# EAGLE design Bus IO Device Simulator (EAGLE 6.6.0)
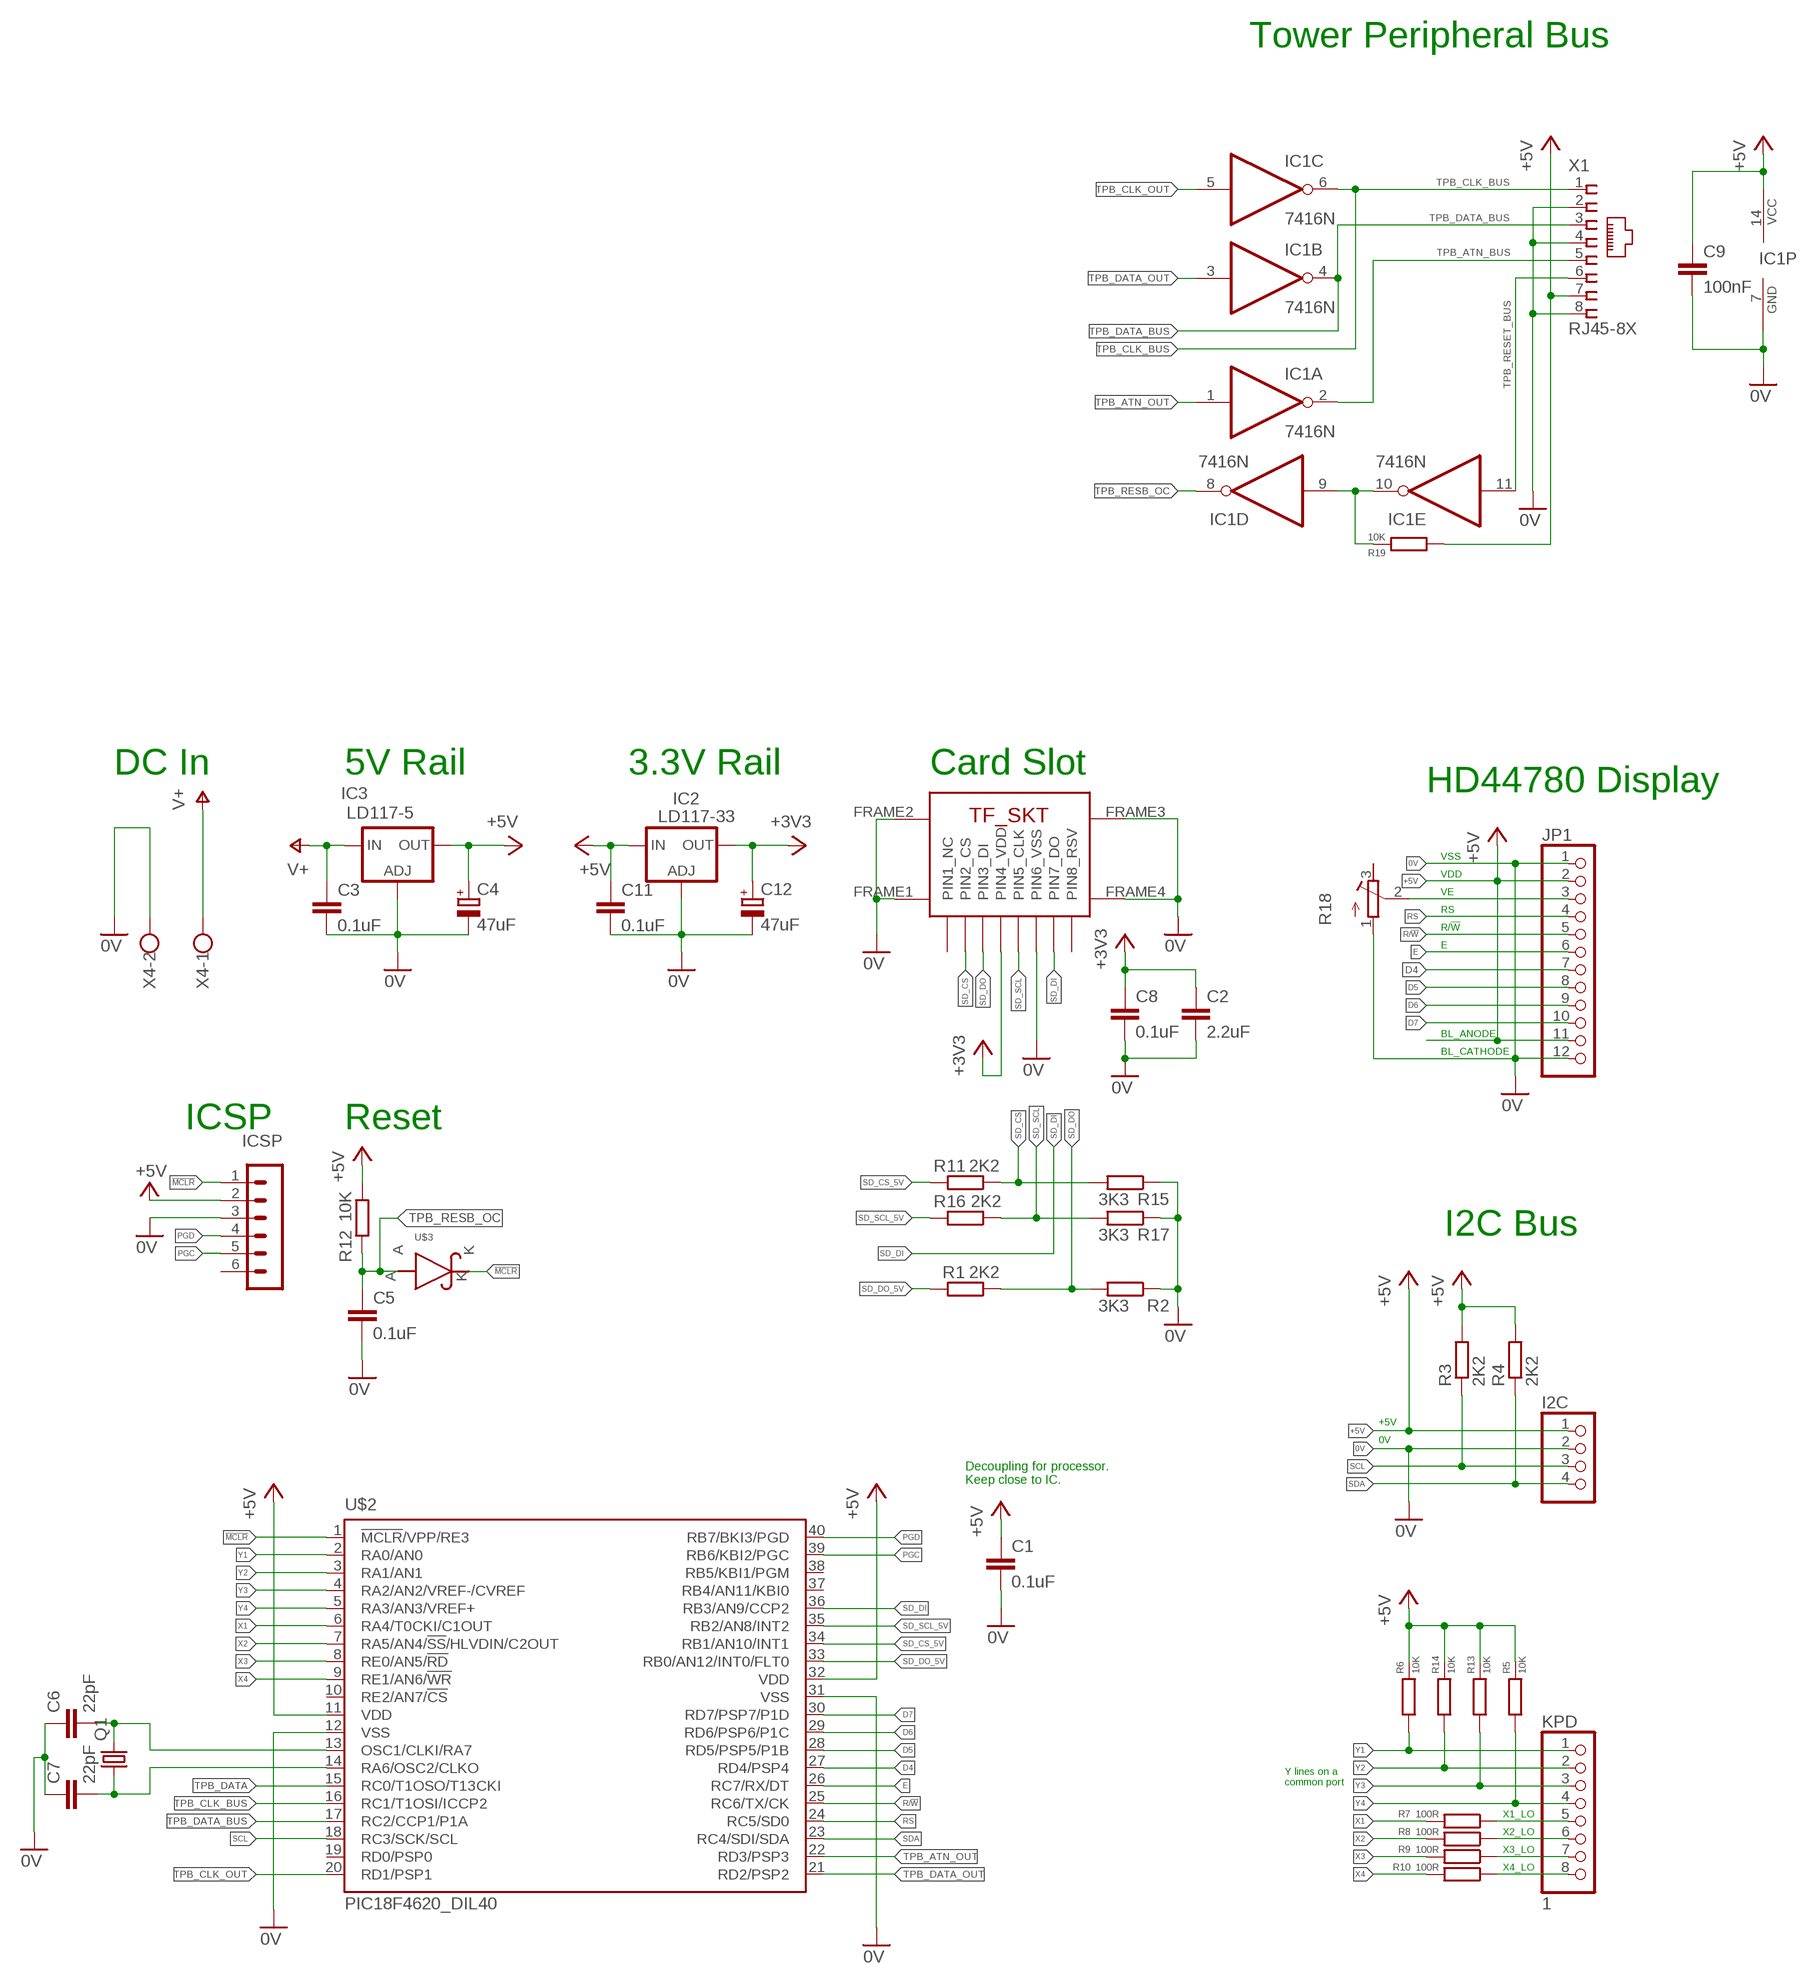
[diagram p0: schematic, sheet 1]

## Parts
C1  0.1uF  C-EUC0603  [C0603]
C2  2.2uF  C-EUC1206  [C1206]
C3  0.1uF  C-EUC0603  [C0603]
C4  47uF  CPOL-EUSMCD  [SMC_D]
C5  0.1uF  C-EUC0603  [C0603]
C6  22pF  C-EUC0603  [C0603]
C7  22pF  C-EUC0603  [C0603]
C8  0.1uF  C-EUC0603  [C0603]
C9  100nF  C-EU050-025X075  [C050-025X075]
C11  0.1uF  C-EUC0603  [C0603]
C12  47uF  CPOL-EUSMCD  [SMC_D]
I2C  PINHD-1X4  [1X04]
IC1  7416N  [DIL14]
IC2  LD117-33  LD117AS50TR  [SOT223]
IC3  LD117-5  LD117AS50TR  [SOT223]
ICSP  MA06-1  [MA06-1]
JP1  PINHD-1X12  [1X12]
KPD  1  PINHD-1X8  [1X08]
Q1  CRYSTALHC49U-V  [HC49U-V]
R1  2K2  R-EU_R0603  [R0603]
R2  3K3  R-EU_R0603  [R0603]
R3  2K2  R-EU_R0603  [R0603]
R4  2K2  R-EU_R0603  [R0603]
R5  10K  R-EU_R0603  [R0603]
R6  10K  R-EU_R0603  [R0603]
R7  100R  R-EU_R0603  [R0603]
R8  100R  R-EU_R0603  [R0603]
R9  100R  R-EU_R0603  [R0603]
R10  100R  R-EU_R0603  [R0603]
R11  2K2  R-EU_R0603  [R0603]
R12  10K  R-EU_R0603  [R0603]
R13  10K  R-EU_R0603  [R0603]
R14  10K  R-EU_R0603  [R0603]
R15  3K3  R-EU_R0603  [R0603]
R16  2K2  R-EU_R0603  [R0603]
R17  3K3  R-EU_R0603  [R0603]
R18  R-TRIMM64W  [RTRIM64W]
R19  10K  R-EU_R0603  [R0603]
U$1  TF_SKT  [CLIP_DOWN]
U$2  PIC18F4620_DIL40  [DIL40]
U$3  ZHCS750  [SOT23]
X1  RJ45-8X  [RJ45-NO-SHIELD]
X4  W237-102  [W237-102]

## Nets
0V: C1.2 C2.2 C3.2 C4.- C5.2 C6.1 C7.1 C8.2 C9.2 C11.2 C12.- I2C.2 IC1.7(P:GND) IC2.1(ADJ) IC3.1(ADJ) ICSP.3 JP1.1 JP1.12 R2.1 R15.1 R17.1 R18.1(E) U$1.FRAME1 U$1.FRAME2 U$1.FRAME3 U$1.FRAME4 U$1.PIN6_VSS U$2.12(VSS) U$2.31(VSS) X1.2 X1.4 X1.8 X4.2
!MCLR: ICSP.1 U$2.1(!MCLR!/VPP/RE3) U$3.K
+3V3: C2.1 C8.1 C12.+ IC2.4(OUT) U$1.PIN4_VDD
+5V: C1.1 C4.+ C9.1 C11.1 I2C.1 IC1.14(P:VCC) IC2.3(IN) IC3.4(OUT) ICSP.2 JP1.2 JP1.11 R3.2 R4.2 R5.2 R6.2 R12.2 R13.2 R14.2 R19.1 U$2.11(VDD) U$2.32(VDD) X1.7
D4: JP1.7 U$2.27(RD4/PSP4)
D5: JP1.8 U$2.28(RD5/PSP5/P1B)
D6: JP1.9 U$2.29(RD6/PSP6/P1C)
D7: JP1.10 U$2.30(RD7/PSP7/P1D)
E: JP1.6 U$2.26(RC7/RX/DT)
N$1: C6.2 Q1.2 U$2.13(OSC1/CLKI/RA7)
N$2: C7.2 Q1.1 U$2.14(RA6/OSC2/CLKO)
N$3: JP1.3 R18.2(S)
N$4: IC1.9(D:I) IC1.10(E:O) R19.2
PGC: ICSP.5 U$2.39(RB6/KBI2/PGC)
PGD: ICSP.4 U$2.40(RB7/BKI3/PGD)
R/!W: JP1.5 U$2.25(RC6/TX/CK)
RS: JP1.4 U$2.24(RC5/SD0)
SCL: I2C.3 R3.1 U$2.18(RC3/SCK/SCL)
SD_CS: R11.1 R15.2 U$1.PIN2_CS
SD_CS_5V: R11.2 U$2.34(RB1/AN10/INT1)
SD_DI: U$1.PIN7_DO U$2.36(RB3/AN9/CCP2)
SD_DO: R1.1 R2.2 U$1.PIN3_DI
SD_DO_5V: R1.2 U$2.33(RB0/AN12/INT0/FLT0)
SD_SCL: R16.1 R17.2 U$1.PIN5_CLK
SD_SCL_5V: R16.2 U$2.35(RB2/AN8/INT2)
SDA: I2C.4 R4.1 U$2.23(RC4/SDI/SDA)
TPB_ATN_BUS: IC1.2(A:O) X1.5
TPB_ATN_OUT: IC1.1(A:I) U$2.22(RD3/PSP3)
TPB_CLK_BUS: IC1.6(C:O) U$2.16(RC1/T1OSI/ICCP2) X1.1
TPB_CLK_OUT: IC1.5(C:I) U$2.20(RD1/PSP1)
TPB_DATA: U$2.15(RC0/T1OSO/T13CKI)
TPB_DATA_BUS: IC1.4(B:O) U$2.17(RC2/CCP1/P1A) X1.3
TPB_DATA_OUT: IC1.3(B:I) U$2.21(RD2/PSP2)
TPB_RESB_OC: C5.1 IC1.8(D:O) R12.1 U$3.A
TPB_RESET_BUS: IC1.11(E:I) X1.6
V+: C3.1 IC3.3(IN) X4.1
X1: R7.2 U$2.6(RA4/T0CKI/C1OUT)
X1_LO: KPD.5 R7.1
X2: R8.2 U$2.7(RA5/AN4/!SS!/HLVDIN/C2OUT)
X2_LO: KPD.6 R8.1
X3: R9.2 U$2.8(RE0/AN5/!RD)
X3_LO: KPD.7 R9.1
X4: R10.2 U$2.9(RE1/AN6/!WR)
X4_LO: KPD.8 R10.1
Y1: KPD.1 R6.1 U$2.2(RA0/AN0)
Y2: KPD.2 R14.1 U$2.3(RA1/AN1)
Y3: KPD.3 R13.1 U$2.4(RA2/AN2/VREF-/CVREF)
Y4: KPD.4 R5.1 U$2.5(RA3/AN3/VREF+)
Unconnected: IC1.12(F:O) IC1.13(F:I) ICSP.6 R18.3(A) U$1.PIN1(PIN1_NC) U$1.PIN8_RSV U$2.10(RE2/AN7/!CS) U$2.19(RD0/PSP0) U$2.37(RB4/AN11/KBI0) U$2.38(RB5/KBI1/PGM)

## Notes on the sheet
- Tower Peripheral Bus
- DC In | 5V Rail | 3.3V Rail | Card Slot
- HD44780 Display
- VSS
- VDD
- VE
- RS
- R/!W
- E
- BL_ANODE
- BL_CATHODE
- ICSP | Reset
- I2C Bus
- +5V
- 0V
- Decoupling for processor.
  Keep close to IC.
- Y lines on a
  common port
- X1_LO
- X2_LO
- X3_LO
- X4_LO

## Library data of the parts
C1-C3 C5-C9 C11 = rcl:C-EU: CAPACITOR, European symbol
C4 C12 = rcl:CPOL-EU: POLARIZED CAPACITOR, European symbol
I2C = pinhead:PINHD-1X4: PIN HEADER
IC1 = 74xx-us:74*16: Hex INVERTER, open collector, high-voltage
IC2 IC3 = v-reg:LD117A?*: Low drop fixed and adjustable positive voltage regulators 1 A Source: http://www.st.com/stonline/products/literature/ds/7194/ld1117axx.pdf
ICSP = con-lstb:MA06-1: PIN HEADER; OC_FARNELL: unknown; OC_NEWARK: unknown
JP1 = pinhead:PINHD-1X12: PIN HEADER
KPD = pinhead:PINHD-1X8: PIN HEADER
Q1 = crystal:CRYSTAL: CRYSTAL; OC_FARNELL: 1666969; OC_NEWARK: unknown
R1-R17 R19 = rcl:R-EU_: RESISTOR, European symbol
R18 = rcl:R-TRIMM: Trimm resistor
U$1 = Duncs Special Conn:TF_SKT: Clipdown Transflash Socket. Footprint for el-cheapo sockets bought from eBay. Delete when exhausted.
U$2 = microchip-pic-extras:PIC18F4620_DIL40: DIL40 Version of the PIC18F4620. 60mil spacing between rows and 10mil between pins on a row. Please note this has not been tested yet
U$3 = Duncs Diodes:ZHCS750: ZHCS750 750mA Schottky signal diode in a SOT-23 package. See datasheet for further information.
X1 = con-tycoelectronics:RJ45: CORCOM Modular RJ Jacks No Shield Source: www.tycoelectronics.com .. ENG_DS_1654001_1099_RJ_L_0507.pdf; MPN: RJ45-8X; OC_FARNELL: unknown; OC_NEWARK: 16R6101
X4 = con-wago-500:W237-102: WAGO SCREW CLAMP; MPN: 237-102; OC_FARNELL: unknown; OC_NEWARK: 70K9898

## Net classes
0 low voltage: width 0.305 mm, clearance 0.203 mm
1 power traces: width 1.016 mm, clearance 0.254 mm

## Board
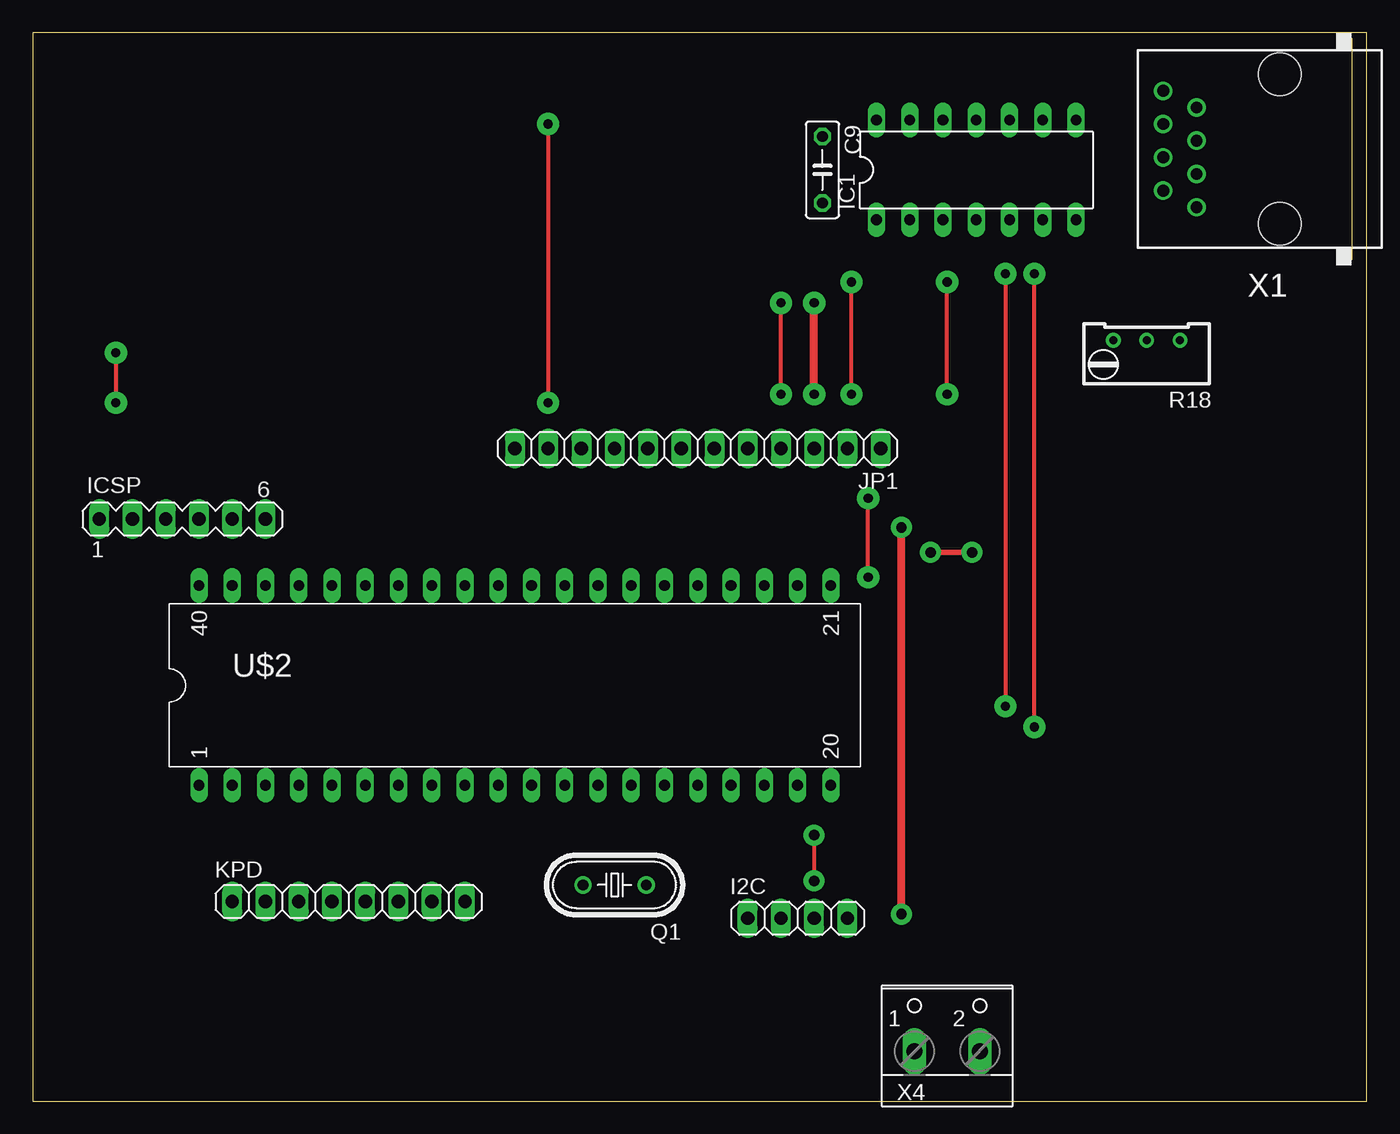
[diagram p1: board, top side]
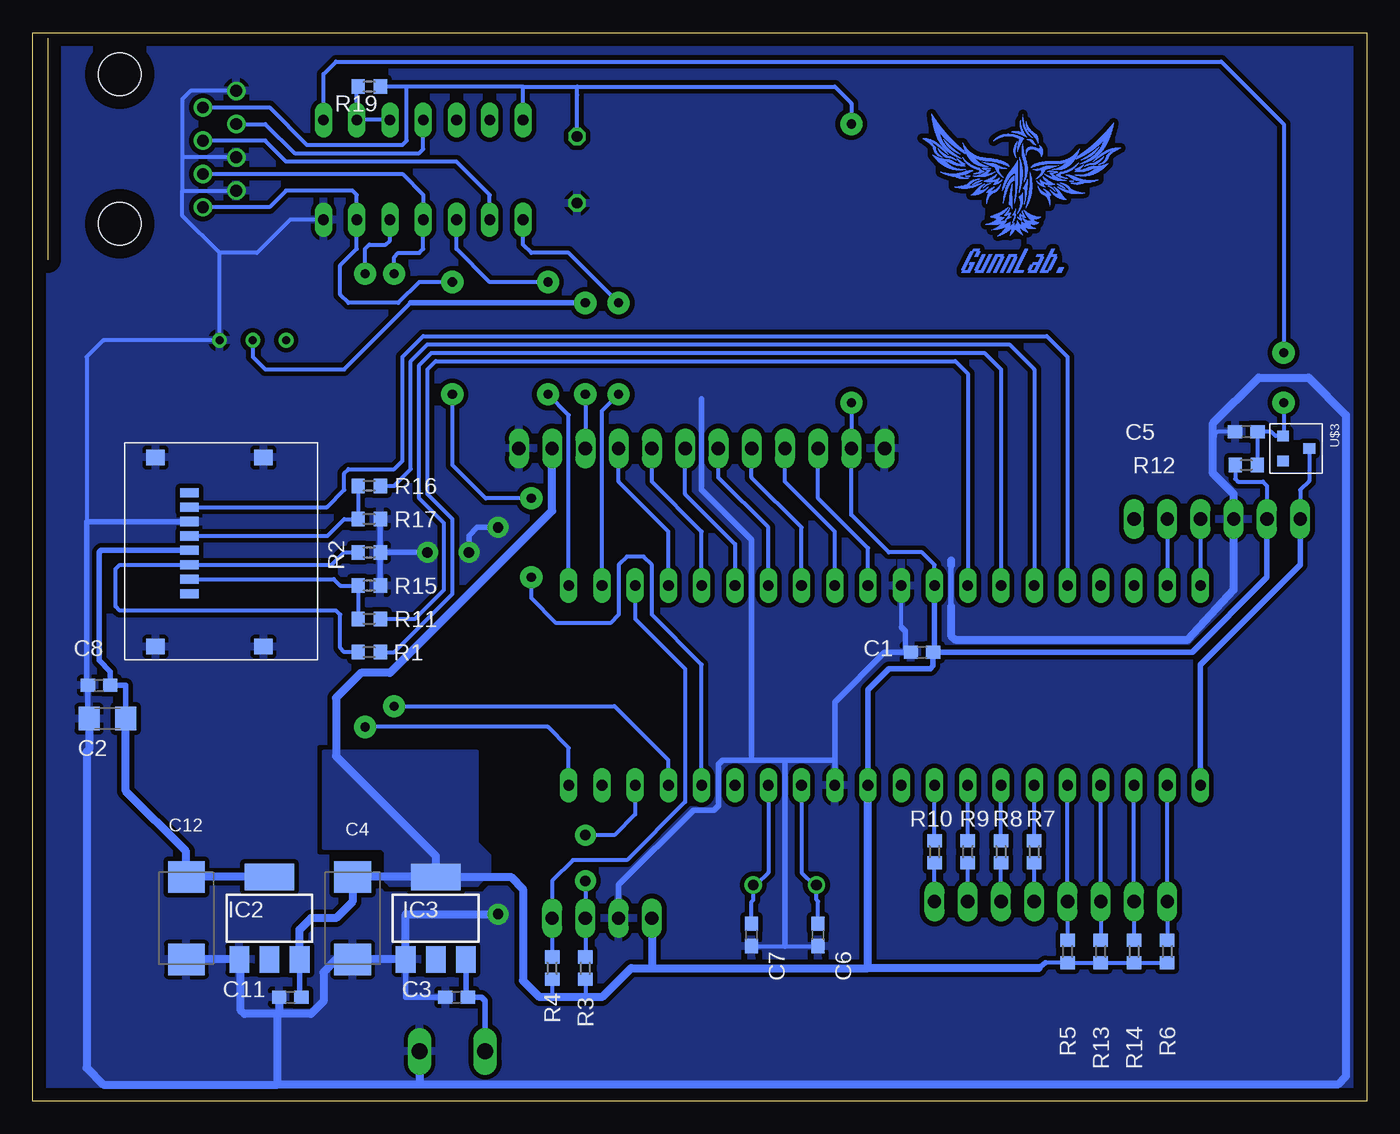
[diagram p2: board, bottom side, seen from below]

Size 101.91 x 81.59 mm. Coordinates in mm from the lower left corner, seen from the top.
Outline: 0,0 101.91,0 101.91,81.59 0,81.59 0,0
Copper layers (1*16): Top 0.035mm / dielectric 1.5mm / Bottom 0.035mm
Design rules "default *": minimum track width 10mil, minimum drill 24mil, track to track 8mil, track to pad 8mil, pad to pad 8mil, via to via 8mil, smd to smd 8mil, copper to edge 40mil, drill to drill 8mil, minimum pad ring 10mil, minimum via ring 8mil, stop-mask expansion 4mil, vias tented up to drill 0mil, thermal gap 12mil

### Footprints (pad centres in the part's own frame; a part is rotated, then mirrored left to right if it is on the bottom)
C0603 = smd 1.1 x 1: 1 -0.85,0; 2 0.85,0
C1206 = smd 1.6 x 1.8: 1 -1.4,0; 2 1.4,0
SMC_D = smd 2.4 x 2.8: + -3.15,0; - 3.15,0
C050-025X075 = drill 0.813 octagon: 1 -2.54,0; 2 2.54,0
1X04 = drill 1.016 long: 1 -3.81,0; 2 -1.27,0; 3 1.27,0; 4 3.81,0
DIL14 = drill 0.813 long: 1 -7.62,-3.81; 2 -5.08,-3.81; 3 -2.54,-3.81; 4 0,-3.81; 5 2.54,-3.81; 6 5.08,-3.81; 7 7.62,-3.81; 8 7.62,3.81; 9 5.08,3.81; 10 2.54,3.81; 11 0,3.81; 12 -2.54,3.81; 13 -5.08,3.81; 14 -7.62,3.81
SOT223 = smd 1.5 x 2: 1 -2.3,-3.15; 2 0,-3.15; 3 2.3,-3.15 | smd 3.8 x 2: 4 0,3.15
MA06-1 = drill 1.016 long: 1 -6.35,0; 2 -3.81,0; 3 -1.27,0; 4 1.27,0; 5 3.81,0; 6 6.35,0
1X12 = drill 1.016 long: 1 -13.97,0; 2 -11.43,0; 3 -8.89,0; 4 -6.35,0; 5 -3.81,0; 6 -1.27,0; 7 1.27,0; 8 3.81,0; 9 6.35,0; 10 8.89,0; 11 11.43,0; 12 13.97,0
1X08 = drill 1.016 long: 1 -8.89,0; 2 -6.35,0; 3 -3.81,0; 4 -1.27,0; 5 1.27,0; 6 3.81,0; 7 6.35,0; 8 8.89,0
HC49U-V = drill 0.813: 1 -2.413,0; 2 2.413,0
R0603 = smd 1 x 1.1: 1 -0.85,0; 2 0.85,0
RTRIM64W = drill 0.61: 1 1.27,-2.54; 2 1.27,0; 3 1.27,2.54
CLIP_DOWN = smd 1.2 x 1.4: FRAME1 -7.2,4.9; FRAME2 7.25,4.9; FRAME3 -7.2,-3.35; FRAME4 7.25,-3.35 | smd 0.7 x 1.4: PIN1 -3.15,2.3; PIN2_CS -2.05,2.3; PIN3_DI -0.95,2.3; PIN4_VDD 0.15,2.3; PIN5_CLK 1.25,2.3; PIN6_VSS 2.35,2.3; PIN7_DO 3.45,2.3; PIN8_RSV 4.55,2.3
DIL40 = drill 0.813 long: 1 -24.13,-7.62; 2 -21.59,-7.62; 3 -19.05,-7.62; 4 -16.51,-7.62; 5 -13.97,-7.62; 6 -11.43,-7.62; 7 -8.89,-7.62; 8 -6.35,-7.62; 9 -3.81,-7.62; 10 -1.27,-7.62; 11 1.27,-7.62; 12 3.81,-7.62; 13 6.35,-7.62; 14 8.89,-7.62; 15 11.43,-7.62; 16 13.97,-7.62; 17 16.51,-7.62; 18 19.05,-7.62; 19 21.59,-7.62; 20 24.13,-7.62; 21 24.13,7.62; 22 21.59,7.62; 23 19.05,7.62; 24 16.51,7.62; 25 13.97,7.62; 26 11.43,7.62; 27 8.89,7.62; 28 6.35,7.62; 29 3.81,7.62; 30 1.27,7.62; 31 -1.27,7.62; 32 -3.81,7.62; 33 -6.35,7.62; 34 -8.89,7.62; 35 -11.43,7.62; 36 -13.97,7.62; 37 -16.51,7.62; 38 -19.05,7.62; 39 -21.59,7.62; 40 -24.13,7.62
SOT23 = smd 0.8 x 0.9: A -0.95,-1; K 0,1; NC 0.95,-1
RJ45-NO-SHIELD = drill 0.9 pad 1.4: 1 -4.445,6.35; 2 -3.175,8.89; 3 -1.905,6.35; 4 -0.635,8.89; 5 0.635,6.35; 6 1.905,8.89; 7 3.175,6.35; 8 4.445,8.89 | hole 3.251: -5.715,0; 5.715,0
W237-102 = drill 1.194 long: 1 -2.5,-1.27; 2 2.5,-1.27

### Placement (x,y rotation side)
C1  33.97,34.29 180 bottom
C2  96.2,29.21 180 bottom
C3  69.53,7.94 180 bottom
C4  77.47,13.97 270 bottom
C5  9.21,51.12 180 bottom
C6  41.91,12.7 90 bottom
C7  46.99,12.7 90 bottom
C8  96.84,31.75 180 bottom
C9  60.33,71.12 270 top
C11  82.23,7.94 180 bottom
C12  90.17,13.97 270 bottom
I2C  58.42,13.97 0 top
IC1  72.07,71.12 0 top
IC2  83.82,13.97 0 bottom
IC3  71.12,13.97 0 bottom
ICSP  11.43,44.45 0 top
JP1  50.8,49.85 180 top
KPD  24.13,15.24 0 top
Q1  44.45,16.51 180 top
R1  76.2,34.29 0 bottom
R2  76.2,41.91 180 bottom
R3  59.69,10.16 270 bottom
R4  62.23,10.16 270 bottom
R5  22.86,11.43 270 bottom
R6  15.24,11.43 270 bottom
R7  25.4,19.05 90 bottom
R8  27.94,19.05 90 bottom
R9  30.48,19.05 90 bottom
R10  33.02,19.05 90 bottom
R11  76.2,36.83 0 bottom
R12  9.21,48.58 180 bottom
R13  20.32,11.43 270 bottom
R14  17.78,11.43 270 bottom
R15  76.2,39.37 180 bottom
R16  76.2,46.99 0 bottom
R17  76.2,44.45 180 bottom
R18  85.09,56.83 90 top
R19  76.2,77.47 180 bottom
U$1  87.63,41.91 90 bottom
U$2  36.83,31.75 0 top
U$3  5.4,49.85 270 bottom
U$4  [LIONTECH]  26.67,69.85 0 top
X1  95.25,72.71 90 top
X4  69.85,5.08 0 top

### Tracks (layer width: path | path; a pad name or v marks a point on that pad's centre or on a via)
0V  (via drill 0.8 pad 1.6)
  Top 0.406: v71.75,41.91 v68.58,41.91
  Top 0.61: v66.36,14.29 v66.36,43.81
  Bottom 0.305: C7.1 44.45,11.85 C6.1 | C5.2 11.43,51.12 11.75,50.8 | 35.56,36.2 U$2.31 | X1.8 89.85,77.15 90.49,76.52 90.49,72.07 | 90.49,72.07 90.49,69.53 | 90.49,69.53 X1.2 | X1.4 90.49,72.07 | 87.63,64.77 R18.1 96.52,58.1 97.79,56.83 97.79,44.13 | 87.63,64.77 90.49,67.63 90.49,69.53 | IC1.7 82.23,67.31 84.77,64.77 87.63,64.77
  Bottom 0.406: C3.2 73.42,7.94 IC3.1 | R15.1 R2.1 | R2.1 R17.1 | U$1.PIN6_VSS 97.79,44.26 97.79,44.13 97.79,31.75 C8.2 97.69,29.21 C2.2 | U$2.12 40.64,26.04 | 44.45,11.85 44.45,26.04 | 44.45,26.04 40.64,26.04 | I2C.2 57.15,16.51 51.44,22.23 49.85,22.23 49.53,22.54 49.53,25.72 49.21,26.04 46.99,26.04 | 35.56,36.2 35.24,35.88 35.24,34.39 C1.2 36.83,34.29 40.64,30.48 40.64,26.04 | R2.1 v71.75,41.91 | v68.58,41.91 68.58,43.18 67.94,43.81 v66.36,43.81 | 31.75,40.96 31.75,37.78 | 46.99,26.04 46.99,42.86 50.8,46.67 50.8,53.66 | 46.99,26.04 44.45,26.04
  Bottom 0.61: C12.- IC2.1 86.04,10.74 86.04,6.99 85.72,6.67 83.19,6.67 | v66.36,14.29 73.42,14.29 IC3.1 C4.- 78.72,10.82 79.69,9.84 79.69,7.62 80.64,6.67 83.19,6.67 | C11.2 83.08,6.77 83.19,6.67 | 72.39,1.27 2.22,1.27 1.59,1.91 1.59,52.39 4.45,55.24 8.26,55.24 11.75,51.75 11.75,50.8 11.75,47.94 10.16,46.35 ICSP.3 10.16,39.05 13.65,35.24 31.43,35.24 31.75,35.56 31.75,37.78 | 72.39,1.27 83.19,1.27 | 83.19,1.27 83.19,6.67 | X4.2 72.35,1.31 72.39,1.27 | 83.19,1.27 96.52,1.27 97.79,2.54 97.79,26.67 97.6,26.86 C2.2 | 31.75,41.27 31.75,40.96
  pour Bottom (isolate 0.356, rank 2): 101.92,81.6 101.6,0 0,0 0.32,81.6
!MCLR
  Bottom 0.305: U$3.K 4.4,47.35 5.08,46.67 ICSP.1
  Bottom 0.406: ICSP.1 5.08,40.96 12.7,33.34 U$2.1
+3V3
  Bottom 0.406: U$1.PIN4_VDD 96.69,42.06 96.84,41.91 96.84,33.66 95.99,32.8 C8.1 94.8,31.75 C2.1 | 90.19,17.14 C12.+
  Bottom 0.61: IC2.4 C12.+ | 90.19,17.14 90.19,19.07 94.8,23.68 C2.1
+5V  (via drill 0.7 pad 1.7)
  Top 0.305: v39.37,74.61 v39.37,53.34
  Bottom 0.305: R6.2 R14.2 R13.2 R5.2 24.55,10.58 | R12.2 10.06,47.52 9.84,47.31 7.94,47.31 7.62,46.99 ICSP.2 | R3.2 59.69,7.94 | R4.2 62.23,7.94 | U$2.32 33.02,40.96 33.97,41.91 36.51,41.91 39.37,44.77 JP1.11 v39.37,53.34 | X1.7 83.82,75.88 80.96,73.03 73.66,73.03 73.34,73.34 73.34,77.47 | 73.34,77.47 R19.1 | IC1.14 64.45,77.47 | 64.45,77.47 73.34,77.47 | 60.33,76.83 C9.1 60.33,77.47 | 64.45,77.47 60.33,77.47 | 60.33,77.47 40.64,77.47 39.37,76.2 v39.37,74.61
  Bottom 0.406: IC2.3 81.52,7.94 C11.1 | U$2.32 33.02,34.29 | U$2.11 38.1,31.43 36.51,33.02 33.34,33.02 33.12,33.23 C1.1 33.34,34.39 33.34,33.97 33.02,34.29 | 24.55,10.58 25.08,10.16 | 33.02,34.29 13.34,34.29 7.62,40.01 ICSP.2
  Bottom 0.61: IC3.4 C4.+ 77.47,15.24 78.74,13.97 80.64,13.97 81.52,13.1 IC2.3 | 25.08,10.16 38.1,10.16 | 38.1,10.16 U$2.11 | 54.61,10.16 56.2,10.16 58.42,7.94 59.69,7.94 62.23,7.94 63.18,7.94 64.45,9.21 64.45,16.19 65.38,17.12 IC3.4 | 54.61,10.16 38.1,10.16 | I2C.1 54.61,10.16 | IC3.4 71.12,18.73 78.74,26.35 78.74,30.8 76.83,32.7 74.61,32.7 62.23,45.09 JP1.2
  pour Bottom (isolate 0.356, no thermals): 74.93,19.05 74.93,16.83 74.61,16.51 67.94,16.51 66.99,17.46 66.99,18.73 67.94,19.68 67.94,26.67 79.69,26.67 79.69,19.37 75.25,19.37
D4
  Bottom 0.305: U$2.27 45.72,43.81 49.53,47.62 JP1.7
D5
  Bottom 0.305: U$2.28 43.18,43.81 46.99,47.62 JP1.8
D6
  Bottom 0.305: U$2.29 40.64,43.5 44.45,47.31 JP1.9
D7
  Bottom 0.305: U$2.30 38.1,42.23 41.91,46.04 JP1.10
E
  Bottom 0.305: U$2.26 48.26,42.55 52.07,46.35 JP1.6
N$1
  Bottom 0.305: U$2.13 43.18,17.46 42.23,16.51 Q1.2 42.04,15.37 41.91,15.24 C6.2
N$2
  Bottom 0.305: U$2.14 45.72,17.46 46.67,16.51 Q1.1 46.86,15.37 46.99,15.24 C7.2
N$3  (via drill 0.7 pad 1.7)
  Top 0.61: v59.69,53.98 v59.69,60.96
  Bottom 0.305: R18.2 85.09,56.83 84.14,55.88 78.11,55.88 73.03,60.96 | v59.69,53.98 JP1.3
  Bottom 0.406: v59.69,60.96 73.03,60.96
N$4
  Bottom 0.305: IC1.10 IC1.9 77.15,77.37 R19.2
PGC
  Bottom 0.305: ICSP.5 U$2.39
PGD
  Bottom 0.305: ICSP.4 U$2.40
R/!W
  Bottom 0.305: U$2.25 50.8,43.5 54.61,47.31 JP1.5
RS
  Bottom 0.305: U$2.24 53.34,43.5 57.15,47.31 JP1.4
SCL  (via drill 0.8 pad 1.6)
  Top 0.305: v59.69,20.32 v59.69,16.83
  Bottom 0.305: R3.1 I2C.3 v59.69,16.83 | U$2.18 55.88,21.91 57.47,20.32 v59.69,20.32
SD_CS
  Bottom 0.305: U$1.PIN2_CS 78.91,39.86 78.42,39.37 R15.2 R11.1
SD_CS_5V
  Bottom 0.305: R11.2 72.71,36.83 70.48,39.05 70.48,44.13 72.39,46.04 72.39,56.2 71.44,57.15 29.21,57.15 27.94,55.88 U$2.34
SD_DI
  Bottom 0.305: U$1.PIN7_DO 79.42,45.36 78.11,46.67 78.11,47.94 77.79,48.26 74.3,48.26 73.66,48.9 73.66,56.83 72.07,58.42 24.45,58.42 22.86,56.83 U$2.36
SD_DO
  Bottom 0.305: R2.2 78.11,41.91 79.06,40.96 U$1.PIN3_DI 95.25,40.96 95.57,40.64 95.57,37.78 95.25,37.47 78.74,37.47 78.42,37.15 78.42,34.61 78.11,34.29 R1.1
SD_DO_5V
  Bottom 0.305: R1.2 74.3,34.29 69.85,38.73 69.85,44.45 71.75,46.35 71.75,55.88 71.12,56.52 31.43,56.52 30.48,55.56 U$2.33
SD_SCL
  Bottom 0.305: U$1.PIN5_CLK 79.39,43.16 78.11,44.45 R17.2 R16.1
SD_SCL_5V
  Bottom 0.305: R16.2 74.3,46.99 73.03,48.26 73.03,56.52 71.75,57.78 27.3,57.78 25.4,55.88 U$2.35
SDA
  Bottom 0.305: R4.1 I2C.4 62.23,16.83 60.64,18.41 56.52,18.41 52.07,22.86 52.07,33.02 55.88,36.83 U$2.23
TPB_ATN_BUS
  Bottom 0.305: IC1.2 66.99,69.22 69.53,71.75 82.55,71.75 84.14,73.34 X1.5
TPB_ATN_OUT  (via drill 0.7 pad 1.7)
  Top 0.305: v57.15,53.98 v57.15,60.96
  Bottom 0.305: U$2.22 58.42,52.7 v57.15,53.98 | v57.15,60.96 60.96,64.77 63.82,64.77 64.45,65.41 IC1.1
TPB_CLK_BUS  (via drill 0.7 pad 1.7)
  Top 0.305: v63.82,40.01 v63.82,46.04 | v69.85,53.98 v69.85,62.55
  Bottom 0.305: X1.1 83.82,68.26 82.55,69.53 77.47,69.53 77.15,69.22 IC1.6 77.15,65.09 78.42,63.82 78.42,61.59 77.79,60.96 73.98,60.96 72.39,62.55 v69.85,62.55 | U$2.16 50.8,33.34 54.61,37.15 54.61,40.96 55.24,41.59 56.52,41.59 57.15,40.96 57.15,37.15 57.78,36.51 61.91,36.51 63.82,38.42 v63.82,40.01 | v63.82,46.04 67.31,46.04 69.85,48.58 v69.85,53.98
TPB_CLK_OUT  (via drill 0.7 pad 1.7)
  Top 0.305: v76.52,28.57 v76.52,63.18
  Bottom 0.305: U$2.20 60.96,26.99 62.55,28.57 v76.52,28.57 | v76.52,63.18 76.52,65.09 76.2,65.41 74.93,65.41 74.61,65.72 IC1.5
TPB_DATA_BUS  (via drill 0.7 pad 1.7)
  Top 0.305: v74.3,63.18 v74.3,30.16
  Bottom 0.305: X1.3 73.66,70.8 72.07,69.22 IC1.4 72.07,65.09 72.39,64.77 73.98,64.77 74.3,64.45 v74.3,63.18 | U$2.17 53.34,26.04 57.47,30.16 v74.3,30.16
TPB_DATA_OUT  (via drill 0.7 pad 1.7)
  Top 0.305: v62.55,53.98 v62.55,62.55
  Bottom 0.305: U$2.21 60.96,52.39 v62.55,53.98 | v62.55,62.55 66.99,62.55 69.53,65.09 IC1.3
TPB_RESB_OC  (via drill 0.7 pad 1.7)
  Top 0.305: v6.35,57.15 v6.35,53.34
  Bottom 0.305: U$3.A | U$3.A 6.98,50.8 7.3,51.12 C5.1 R12.1 | IC1.8 79.69,78.42 78.74,79.38 11.11,79.38 6.35,74.61 v6.35,57.15 | v6.35,53.34 6.35,50.84 U$3.A
TPB_RESET_BUS
  Bottom 0.305: X1.6 84.14,74.61 81.92,72.39 72.39,72.39 72.07,72.71 IC1.11
V+
  Bottom 0.406: IC3.3 68.82,7.94 C3.1 67.63,7.94 67.35,7.66 X4.1
X1
  Bottom 0.305: R7.2 U$2.6
X1_LO
  Bottom 0.305: KPD.5 R7.1
X2
  Bottom 0.305: R8.2 U$2.7
X2_LO
  Bottom 0.305: KPD.6 R8.1
X3
  Bottom 0.305: R9.2 U$2.8
X3_LO
  Bottom 0.305: KPD.7 R9.1
X4
  Bottom 0.305: R10.2 U$2.9
X4_LO
  Bottom 0.305: KPD.8 R10.1
Y1
  Bottom 0.305: R6.1 KPD.1 U$2.2
Y2
  Bottom 0.305: R14.1 KPD.2 U$2.3
Y3
  Bottom 0.305: R13.1 KPD.3 U$2.4
Y4
  Bottom 0.305: R5.1 KPD.4 U$2.5

### Text on the board
bStop: TPB Simulator V1.0 | by Duncan Gunn.